# EAGLE design OMNIBUS Stepper board v3 (EAGLE 9.3.1)
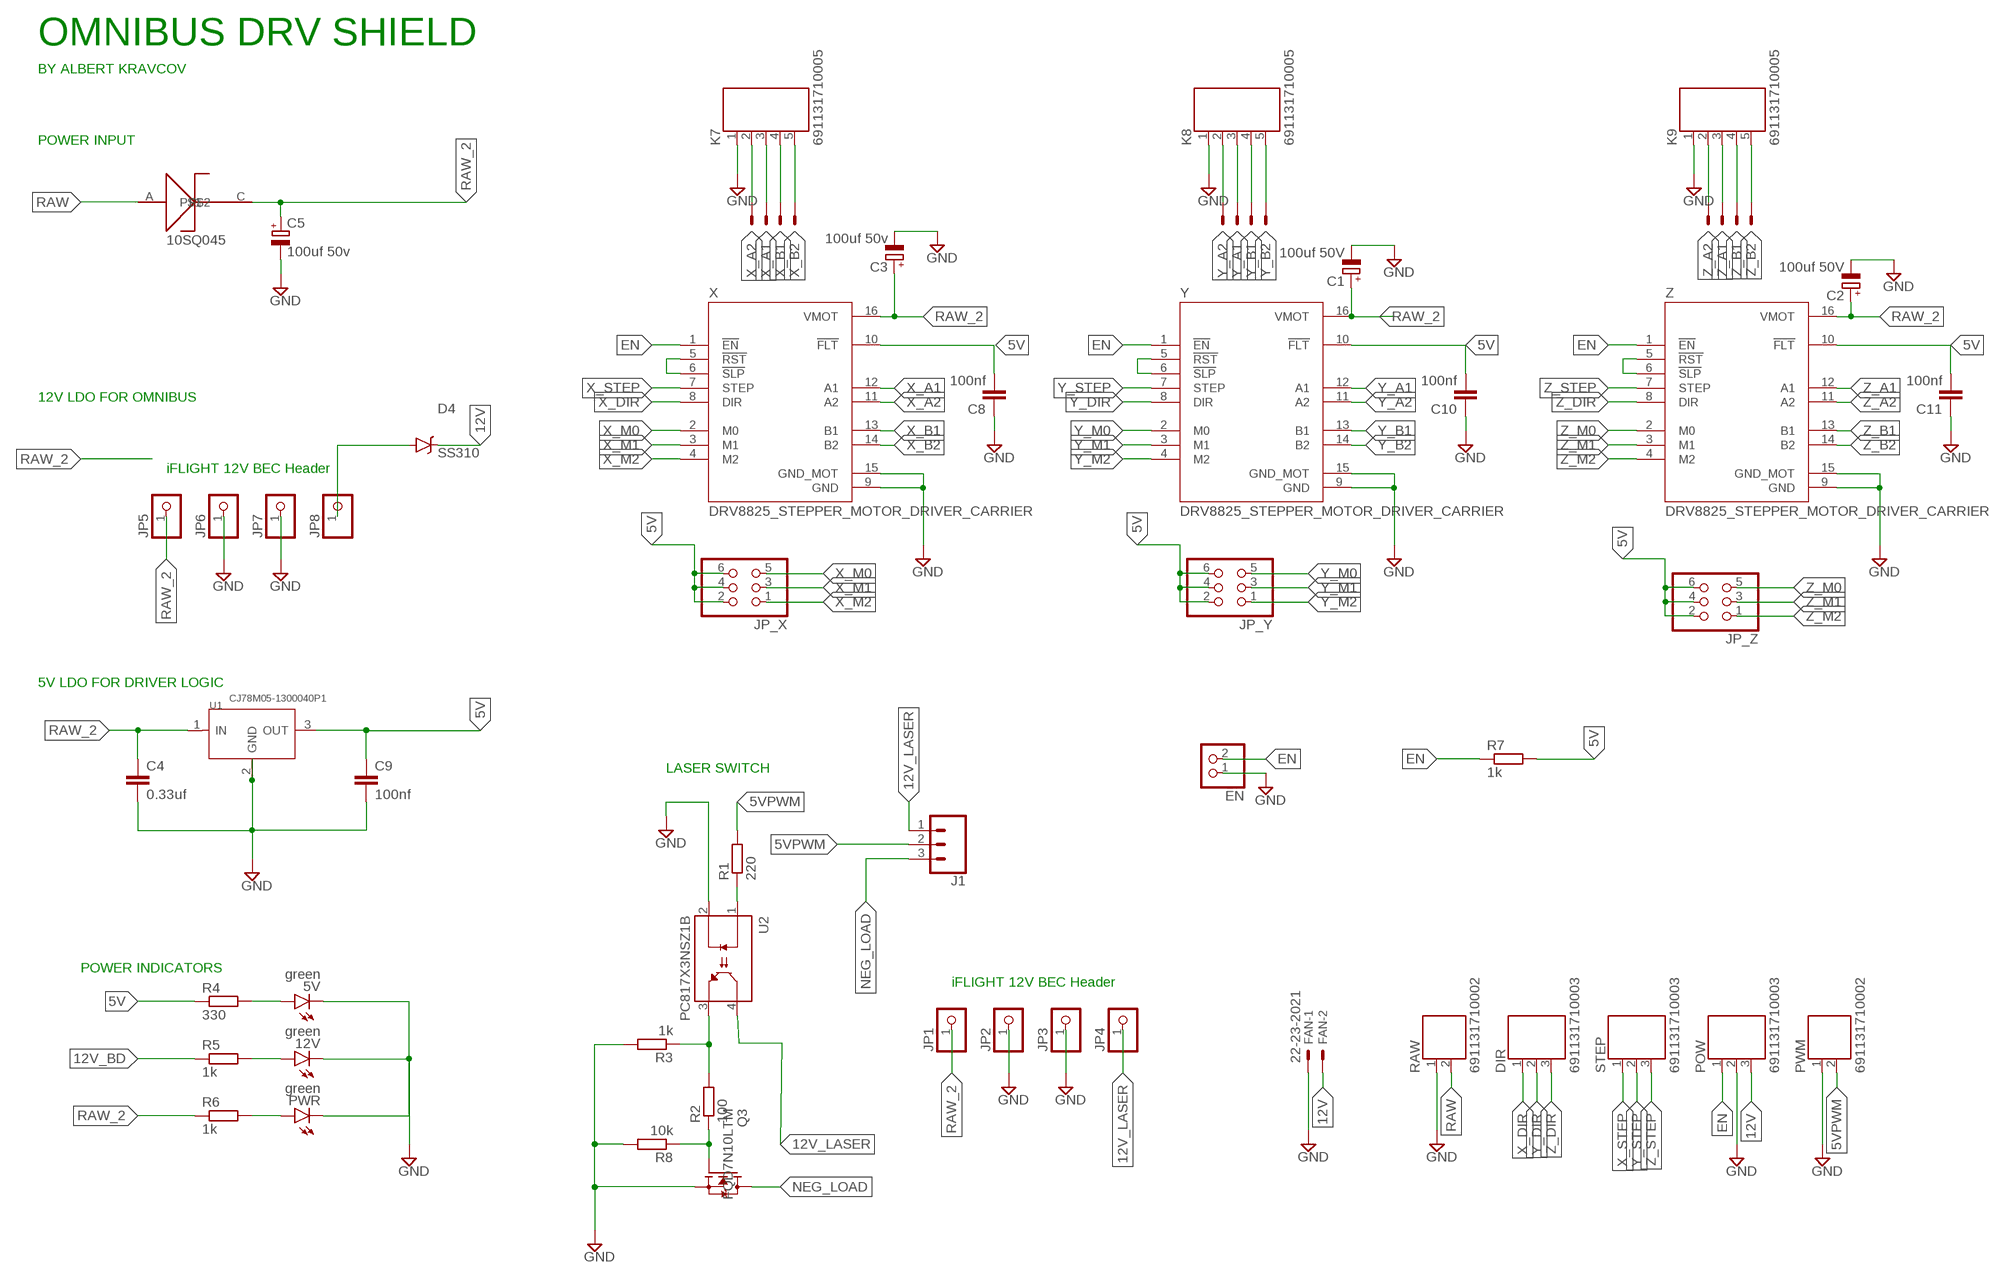
[diagram p0: schematic, sheet 1]

## Parts
5V  green  LEDCHIPLED_0805  [CHIPLED_0805]
12V  green  LEDCHIPLED_0805  [CHIPLED_0805]
C1  100uf 50V  CPOL-EUE5-6  [E5-6]
C2  100uf 50V  CPOL-EUE5-6  [E5-6]
C3  100uf 50v  CPOL-EUE5-6  [E5-6]
C4  0.33uf  C-EUC1206  [C1206]
C5  100uf 50v  CPOL-EUE5-8.5  [E5-8,5]
C8  100nf  C-EUC0805  [C0805]
C9  100nf  C-EUC1206  [C1206]
C10  100nf  C-EUC0805  [C0805]
C11  100nf  C-EUC0805  [C0805]
D1  10SQ045  10SQ050  [DIOAD885W125L910D885]
D4  SS310  SS54  [DO-214AC]
DIR  691131710003  [691131710003]
EN  PINHD-1X2  [1X02]
FAN  22-23-2021  [22-23-2021]
J1  CONN_03  [1X03]
JP1  PINHD-1X1  [1X01]
JP2  PINHD-1X1  [1X01]
JP3  PINHD-1X1  [1X01]
JP4  PINHD-1X1  [1X01]
JP5  PINHD-1X1  [1X01]
JP6  PINHD-1X1  [1X01]
JP7  PINHD-1X1  [1X01]
JP8  PINHD-1X1  [1X01]
JP_X  PINHD-2X3  [2X03]
JP_Y  PINHD-2X3  [2X03]
JP_Z  PINHD-2X3  [2X03]
K7  691131710005  [691131710005]
K8  691131710005  [691131710005]
K9  691131710005  [691131710005]
POW  691131710003  [691131710003]
PWM  691131710002  [691131710002]
PWR  green  LEDCHIPLED_0805  [CHIPLED_0805]
Q3  FQD7N10LTM  [TO-252]
R1  220  R-EU_R0805  [R0805]
R2  100  R-EU_R0805  [R0805]
R3  1k  R-EU_R0805  [R0805]
R4  330  R-EU_R0805  [R0805]
R5  1k  R-EU_R0805  [R0805]
R6  1k  R-EU_R1206  [R1206]
R7  1k  R-EU_R0805  [R0805]
R8  10k  R-EU_R0805  [R0805]
RAW  691131710002  [691131710002]
STEP  691131710003  [691131710003]
U1  CJ78M05-1300040P1  [TO252]
U2  PC817X3NSZ1B  [DIP762W50P254L495H455Q4]
X  DRV8825_STEPPER_MOTOR_DRIVER_CARRIER  [IC_DRV8825_STEPPER_MOTOR_DRIVER_CARRIER]
X_MOTOR  22-23-2041  [22-23-2041]
Y  DRV8825_STEPPER_MOTOR_DRIVER_CARRIER  [IC_DRV8825_STEPPER_MOTOR_DRIVER_CARRIER]
Y_MOTOR  22-23-2041  [22-23-2041]
Z  DRV8825_STEPPER_MOTOR_DRIVER_CARRIER  [IC_DRV8825_STEPPER_MOTOR_DRIVER_CARRIER]
Z_MOTOR  22-23-2041  [22-23-2041]

## Nets
5V [power]: C8.2 C9.1 C10.2 C11.2 JP_X.2 JP_X.4 JP_X.6 JP_Y.2 JP_Y.4 JP_Y.6 JP_Z.2 JP_Z.4 JP_Z.6 R4.1 R7.2 U1.3(OUT) X.10(!FLT) Y.10(!FLT) Z.10(!FLT)
5VPWM [power]: J1.2 PWM.2 R1.2
12V [ha]: D4.C FAN.2 POW.3
12V_BD [ha]: D4.A JP8.1 R5.1
12V_LASER [ha]: J1.1 JP4.1 U2.4(COLLECTOR)
EN: EN.2 POW.1 R7.1 X.1(!EN) Y.1(!EN) Z.1(!EN)
GND: 5V.C 12V.C C1.- C2.- C3.- C4.2 C5.- C8.1 C9.2 C10.1 C11.1 EN.1 FAN.1 JP2.1 JP3.1 JP6.1 JP7.1 K7.1 K8.1 K9.1 POW.2 PWM.1 PWR.C Q3.3(S) R3.2 R8.2 RAW.1 U1.2(GND) U2.2(CATHODE) X.9(GND) X.15(GND_MOT) Y.9(GND) Y.15(GND_MOT) Z.9(GND) Z.15(GND_MOT)
N$1: Q3.1(G) R2.1 R8.1
N$2: 5V.A R4.2
N$3 [power]: R1.1 U2.1(ANODE)
N$4 [power]: R2.2 R3.1 U2.3(EMITTER)
N$7: 12V.A R5.2
N$10: PWR.A R6.2
NC [power]: Z.5(!RST) Z.6(!SLP)
NC2 [power]: Y.5(!RST) Y.6(!SLP)
NC3 [power]: X.5(!RST) X.6(!SLP)
NEG_LOAD [power]: J1.3 Q3.T(D)
RAW [ha]: D1.A RAW.2
RAW_2 [ha]: C1.+ C2.+ C3.+ C4.1 C5.+ D1.C JP1.1 JP5.1 R6.1 U1.1(IN) X.16(VMOT) Y.16(VMOT) Z.16(VMOT)
X_A1 [ha]: K7.3 X.12(A1) X_MOTOR.3
X_A2 [ha]: K7.2 X.11(A2) X_MOTOR.4
X_B1 [ha]: K7.4 X.13(B1) X_MOTOR.2
X_B2 [ha]: K7.5 X.14(B2) X_MOTOR.1
X_DIR [power]: DIR.1 X.8(DIR)
X_M0: JP_X.5 X.2(M0)
X_M1: JP_X.3 X.3(M1)
X_M2: JP_X.1 X.4(M2)
X_STEP [power]: STEP.1 X.7(STEP)
Y_A1 [ha]: K8.3 Y.12(A1) Y_MOTOR.3
Y_A2 [ha]: K8.2 Y.11(A2) Y_MOTOR.4
Y_B1 [ha]: K8.4 Y.13(B1) Y_MOTOR.2
Y_B2 [ha]: K8.5 Y.14(B2) Y_MOTOR.1
Y_DIR [power]: DIR.2 Y.8(DIR)
Y_M0: JP_Y.5 Y.2(M0)
Y_M1: JP_Y.3 Y.3(M1)
Y_M2: JP_Y.1 Y.4(M2)
Y_STEP [power]: STEP.2 Y.7(STEP)
Z_A1 [ha]: K9.3 Z.12(A1) Z_MOTOR.3
Z_A2 [ha]: K9.2 Z.11(A2) Z_MOTOR.4
Z_B1 [ha]: K9.4 Z.13(B1) Z_MOTOR.2
Z_B2 [ha]: K9.5 Z.14(B2) Z_MOTOR.1
Z_DIR [power]: DIR.3 Z.8(DIR)
Z_M0: JP_Z.5 Z.2(M0)
Z_M1: JP_Z.3 Z.3(M1)
Z_M2: JP_Z.1 Z.4(M2)
Z_STEP [power]: STEP.3 Z.7(STEP)

## Notes on the sheet
- OMNIBUS DRV SHIELD
- BY ALBERT KRAVCOV
- POWER INPUT
- 10SQ045
- 12V LDO FOR OMNIBUS
- iFLIGHT 12V BEC Header
- 5V LDO FOR DRIVER LOGIC
- LASER SWITCH
- POWER INDICATORS
- iFLIGHT 12V BEC Header

## Library data of the parts
5V 12V PWR = led:LED: LED OSRAM: - CHIPLED LG R971, LG N971, LY N971, LG Q971, LY Q971, LO R971, LY R971 LH N974, LH R974 LS Q976, LO Q976, LY Q976 LO Q996 - Hyper CHIPLED LW Q18S LB Q993, LB Q99A, LB R99A - SideLED LS A670, LO A670, LY A670, LG A670, LP A670 LB A673, LV A673, LT A673, LW A673 LH A674 LY A675 LS A676, LA A676, LO A676, LY A676, LW A676 LS A679, LY A679, LG A679 - Hyper Micro SIDELED® LS Y876, LA Y876, LO Y876, LY Y876 LT Y87S - SmartLED LW L88C, LW L88S LB L89C, LB L89S, LG L890 LS L89K, LO L89K, LY L89K LS L896, LA L896, LO L896, LY L896 - TOPLED LS T670, LO T670, LY T670, LG T670, LP T670 LSG T670, LSP T670, LSY T670, LOP T670, LYG T670 LG T671, LOG T671, LSG T671 LB T673, LV T673, LT T673, LW T673 LH T674 LS T676, LA T676, LO T676, LY T676, LB T676, LH T676, LSB T676, LW T676 LB T67C, LV T67C, LT T67C, LS T67K, LO T67K, LY T67K, LW E67C LS E67B, LA E67B, LO E67B, LY E67B, LB E67C, LV E67C, LT E67C LW T67C LS T679, LY T679, LG T679 LS T770, LO T770, LY T770, LG T770, LP T770 LB T773, LV T773, LT T773, LW T773 LH T774 LS E675, LA E675, LY E675, LS T675 LS T776, LA T776, LO T776, LY T776, LB T776 LHGB T686 LT T68C, LB T68C - Hyper Mini TOPLED® LB M676 - Mini TOPLED Santana® LG M470 LS M47K, LO M47K, LY M47K Source: http://www.osram.convergy.de LUXEON: - LUMILED® LXK2-PW12-R00, LXK2-PW12-S00, LXK2-PW14-U00, LXK2-PW14-V00 LXK2-PM12-R00, LXK2-PM12-S00, LXK2-PM14-U00 LXK2-PE12-Q00, LXK2-PE12-R00, LXK2-PE12-S00, LXK2-PE14-T00, LXK2-PE14-U00 LXK2-PB12-K00, LXK2-PB12-L00, LXK2-PB12-M00, LXK2-PB14-N00, LXK2-PB14-P00, LXK2-PB14-Q00 LXK2-PR12-L00, LXK2-PR12-M00, LXK2-PR14-Q00, LXK2-PR14-R00 LXK2-PD12-Q00, LXK2-PD12-R00, LXK2-PD12-S00 LXK2-PH12-R00, LXK2-PH12-S00 LXK2-PL12-P00, LXK2-PL12-Q00, LXK2-PL12-R00 Source: www.luxeon.com KINGBRIGHT: KA-3528ASYC Source: www.kingbright.com
C1-C3 C5 = rcl:CPOL-EU: POLARIZED CAPACITOR, European symbol; SPICEPREFIX: C
C4 C8-C11 = rcl:C-EU: CAPACITOR, European symbol; SPICEPREFIX: C
D1 = DIOAD885W125L910D885:10SQ050
D4 = SS54:SS54: SCHOTTKY DIODES 40Vpeak, 28Vrms 5A (SBD) SMA(DO-214AC); AVAILABILITY: Unavailable; DESCRIPTION: Digital Switch Unipolar Switch Open Collector Hall Effect SOT-89B; MF: Honeywell Sensing; MP: SS54; PACKAGE: TO-243AA-243 Honeywell Sensing; PRICE: None
DIR POW STEP = Wurth_Terminal_Blocks_Connectors_rev15d:691131710003: WR-TBL Terminal block - CUU5/3 - 3 Pins;=>Code : Con_TBL_Screw_PClamp_5.00_6911317100xx_691131710003 <http://katalog.we-online.de/media/images/eican/Con_TBL_Screw_PClamp_5.00_6911317100xx_pf2.jpg> Details see: http://katalog.we-online.de/em/datasheet/6911317100xx.pdf Created 11/3/2014, Karrer Zheng 2014 (C) Wurth Elektronik
EN = pinhead:PINHD-1X2: PIN HEADER
FAN = con-molex:22-23-2021: .100" (2.54mm) Center Header - 2 Pin; MF: MOLEX; MPN: 22-23-2021; OC_FARNELL: 1462926; OC_NEWARK: 25C3832
J1 = SparkFun-Connectors:CONN_03: Multi connection point. Often used as Generic Header-pin footprint for 0.1 inch spaced/style header connections On any of the 0.1 inch spaced packages, you can populate with these: Break Away Headers - Straight <https://www.sparkfun.com/products/116> (PRT-00116) Break Away Male Headers - Right Angle <https://www.sparkfun.com/products/553> (PRT-00553) Female Headers <https://www.sparkfun.com/products/115> (PRT-00115) Break Away Headers - Machine Pin <https://www.sparkfun.com/products/117> (PRT-00117) Break Away Female Headers - Swiss Machine Pin <https://www.sparkfun.com/products/743> (PRT-00743) Stackable Header - 3 Pin (Female, 0.1") <https://www.sparkfun.com/products/13875> (PRT-13875) For SCREWTERMINALS and SPRING TERMINALS visit here: Screw Terimnals on SparkFun.com <https://www.sparkfun.com/search/results?term=Screw+Terminals> (5mm/3.5mm/2.54mm spacing) This device is also useful as a general connection point to wire up your design to another part of your project. Our various solder wires solder well into these plated through hole pads. Hook-Up Wire - Assortment (Stranded, 22 AWG) <https://www.sparkfun.com/products/11375> (PRT-11375) Hook-Up Wire - Assortment (Solid Core, 22 AWG) <https://www.sparkfun.com/products/11367> (PRT-11367) View the entire wire category on our website here <https://www.sparkfun.com/categories/141> Special notes: Molex polarized connector foot print use with SKU : PRT-08232 with associated crimp pins and housings.
JP1-JP8 = pinhead:PINHD-1X1: PIN HEADER
JP_X JP_Y JP_Z = pinhead:PINHD-2X3: PIN HEADER
K7-K9 = Wurth_Terminal_Blocks_Connectors_rev15d:691131710005: WR-TBL Terminal block - CUU5/5 - 5 Pins;=>Code : Con_TBL_Screw_PClamp_5.00_6911317100xx_691131710005 <http://katalog.we-online.de/media/images/eican/Con_TBL_Screw_PClamp_5.00_6911317100xx_pf2.jpg> Details see: http://katalog.we-online.de/em/datasheet/6911317100xx.pdf Created 11/3/2014, Karrer Zheng 2014 (C) Wurth Elektronik
PWM RAW = Wurth_Terminal_Blocks_Connectors_rev15d:691131710002: WR-TBL Terminal block - CUU5/2 CUU5/2GR - 2 Pins;=>Code : Con_TBL_Screw_PClamp_5.00_6911317100xx_691131710002 <http://katalog.we-online.de/media/images/eican/Con_TBL_Screw_PClamp_5.00_6911317100xx_pf2.jpg> Details see: http://katalog.we-online.de/em/datasheet/6911317100xx.pdf Created 11/23/2014, Karrer Zheng 2014 (C) Wurth Elektronik
Q3 = FQD7N10LTM:FQD7N10LTM: MOSFET N-CH 100V 5.8A 350mOhm 6nC DPAK Check prices <https://pricing.snapeda.com/parts/FQD7N10LTM/ON%20Semiconductor/view-part?ref=eda>; AVAILABILITY: Good; DESCRIPTION: N-Channel 100V 5.8A (Tc) 2.5W (Ta), 25W (Tc) Surface Mount D-Pak; MF: ON Semiconductor; MP: FQD7N10LTM; PACKAGE: TO-252-3 ON Semiconductor; PRICE: None; PURCHASE-URL: https://pricing.snapeda.com/search/part/FQD7N10LTM/?ref=eda
R1-R8 = rcl:R-EU_: RESISTOR, European symbol; SPICEPREFIX: R
U1 = CJ78M05:CJ78M05: 0.5A Three Terminal Positive Voltage Regulators Check prices <https://pricing.snapeda.com/parts/CJ78M05/JCET/view-part?ref=eda>; AVAILABILITY: No availability data; DESCRIPTION: SMD PMIC; LDO; Vin 25V; 5V; 0.5A; Without En; 1-Ch; MF: JCET; MP: CJ78M05; PACKAGE: None; PRICE: None
U2 = PC817X3NSZ1B:PC817X3NSZ1B: Optoisolator Transistor Output 1 Channel 4-DIP Check prices <https://pricing.snapeda.com/parts/PC817X3NSZ1B/Sharp%20Microelectronics/view-part?ref=eda>; AVAILABILITY: Bad; DESCRIPTION: Optoisolator Transistor Output 1 Channel 4-DIP; MF: Sharp Microelectronics; MP: PC817X3NSZ1B; PACKAGE: None; PRICE: None; PURCHASE-URL: https://pricing.snapeda.com/search/part/PC817X3NSZ1B/?ref=eda
X Y Z = DRV8825_STEPPER_MOTOR_DRIVER_CARRIER:DRV8825_STEPPER_MOTOR_DRIVER_CARRIER: Stepper motor controler; IC: DRV8825; 1.5A; Uin mot: 8.2÷45V; AVAILABILITY: Unavailable; DESCRIPTION: Stepper, Bipolar 8.2 ~ 45VDC Supply 1.5A 8.2 ~ 45V Load; MF: Pololu; MP: DRV8825 STEPPER MOTOR DRIVER CARRIER; PACKAGE: None; PRICE: None
X_MOTOR Y_MOTOR Z_MOTOR = con-molex:22-23-2041: .100" (2.54mm) Center Header - 4 Pin; MF: MOLEX; MPN: 22-23-2041; OC_FARNELL: 1462920; OC_NEWARK: 38C0355

## Net classes
0 default: width 0.305 mm, drill 0.305 mm, clearance 0.305 mm
1 power: width 0.635 mm, drill 0.635 mm, clearance 0.635 mm
2 ha: width 1.524 mm, drill 0.762 mm, clearance 1.27 mm

## Board
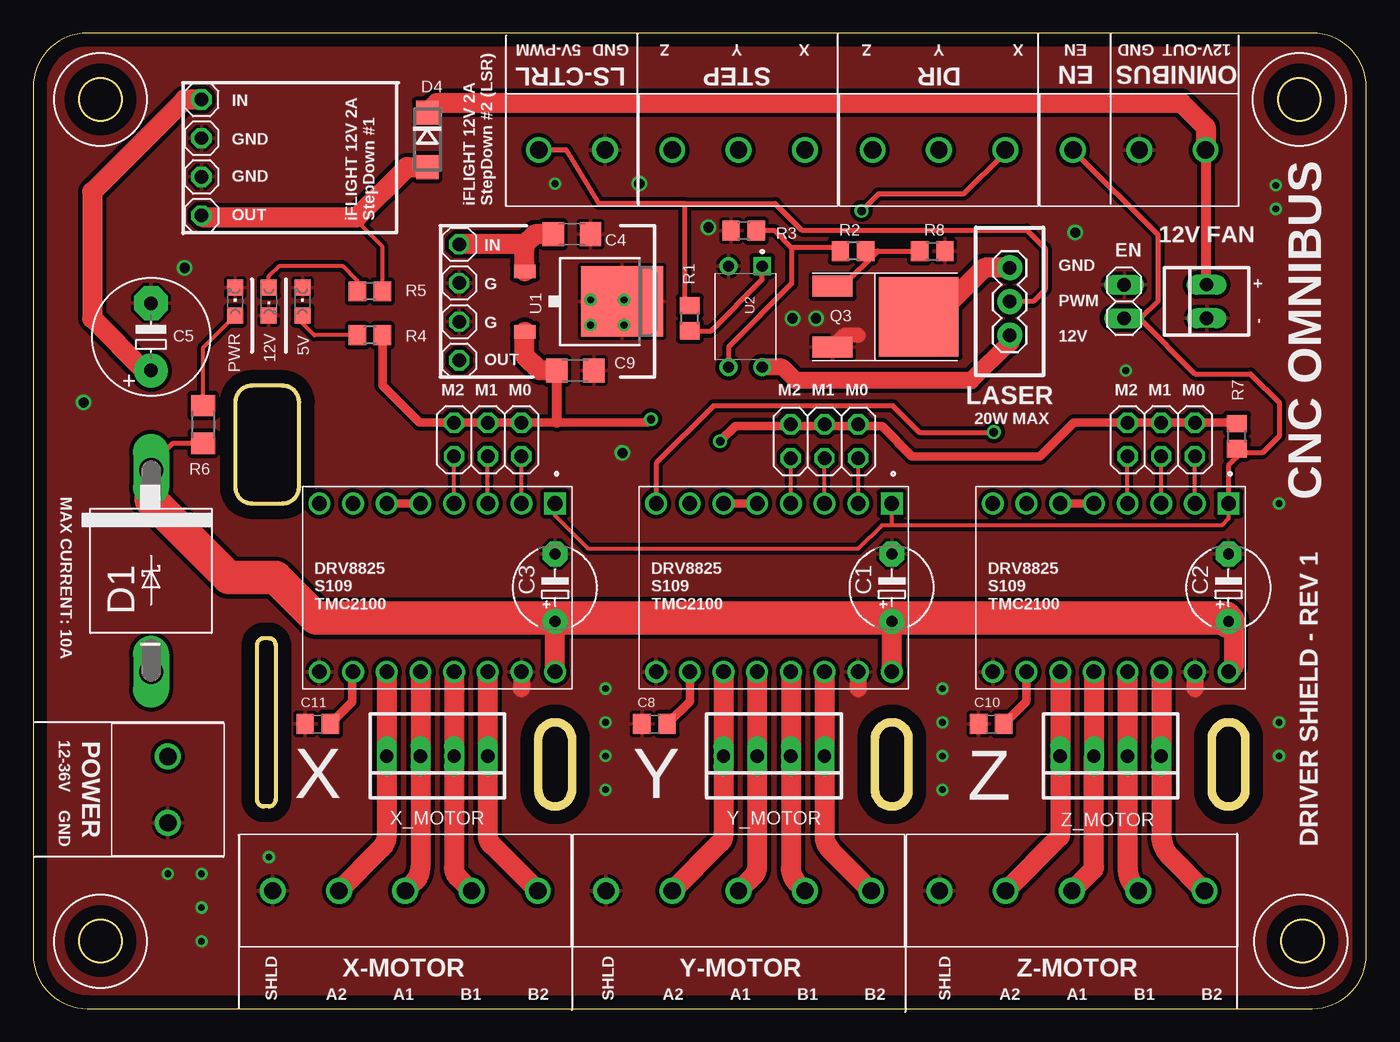
[diagram p1: board, top side]
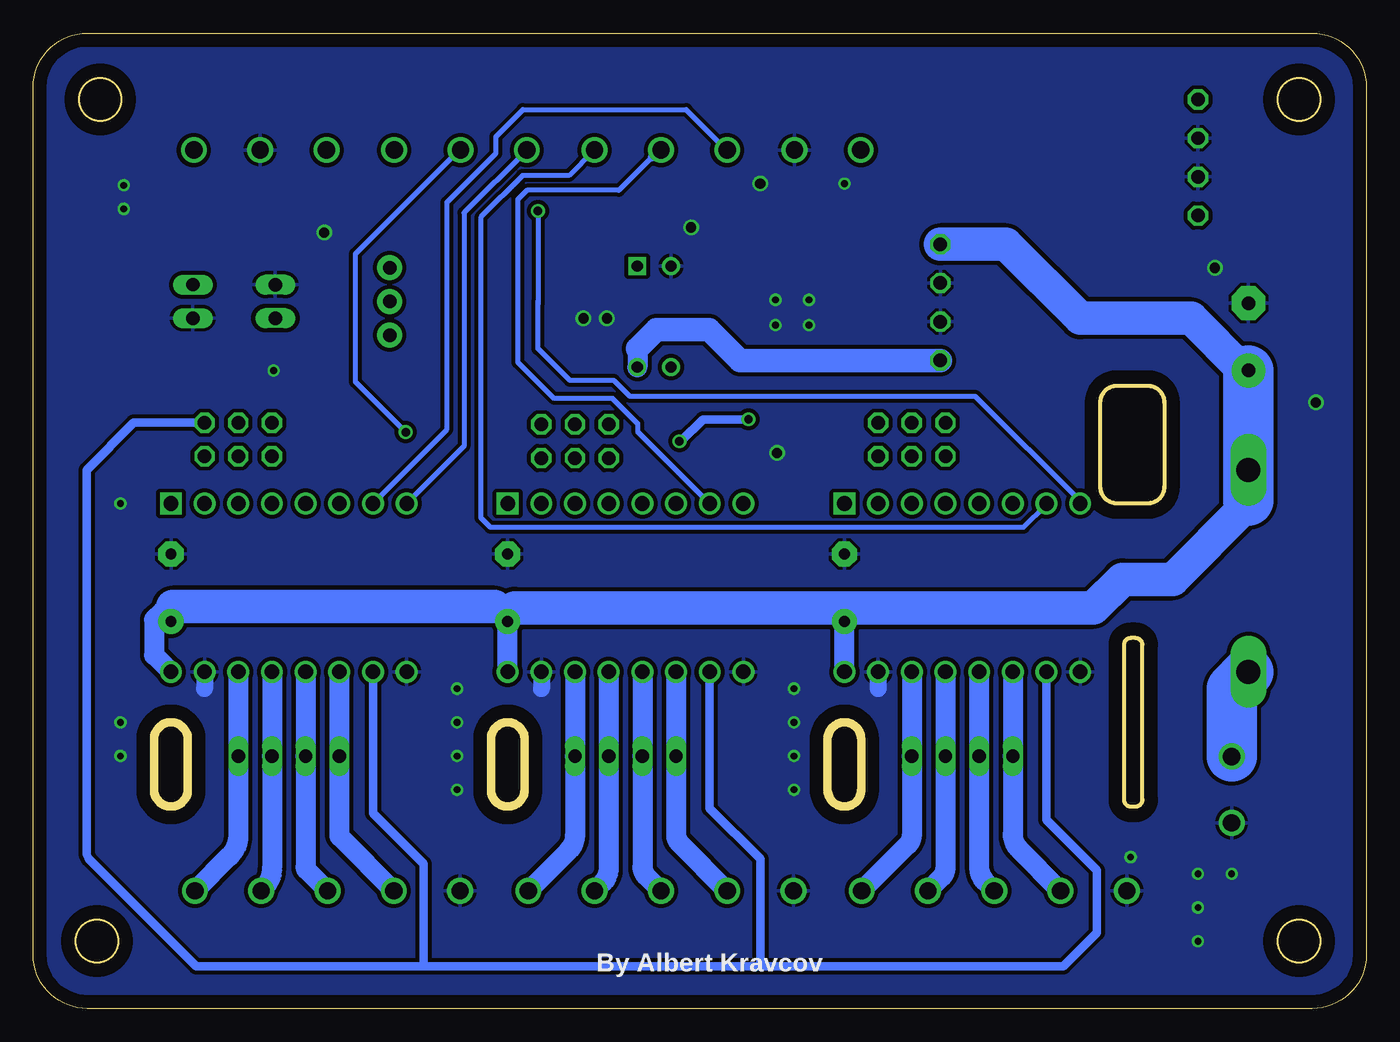
[diagram p2: board, bottom side, seen from below]

Size 100.56 x 73.58 mm. Coordinates in mm from the lower left corner, seen from the top.
Outline: 0,69.52 0,4.06 arc90 4.06,0 96.5,0 arc90 100.56,4.06 100.56,69.52 arc90 96.5,73.58 4.06,73.58 arc90 0,69.52
Outline: 15.24,45.72 15.24,39.37 arc90 16.51,38.1 18.8,38.1 arc90 20.07,39.37 20.07,45.72 arc90 18.8,46.99 16.51,46.99 arc90 15.24,45.72
Outline: 39.37,15.24 arc-90 38.1,16.51 38.1,20.32 arc-90 39.37,21.59 arc-90 40.64,20.32 40.64,16.51 arc-90 39.37,15.24
Outline: 64.77,15.24 arc-90 63.5,16.51 63.5,20.32 arc-90 64.77,21.59 arc-90 66.04,20.32 66.04,16.51 arc-90 64.77,15.24
Outline: 88.9,16.51 88.9,20.32 arc-90 90.17,21.59 arc-90 91.44,20.32 91.44,16.51 arc-90 90.17,15.24 arc-90 88.9,16.51
Outline: 17.78,15.24 17.4,15.24 arc-90 16.89,15.75 16.89,27.43 arc-90 17.4,27.94 17.78,27.94 arc-90 18.29,27.43 18.29,15.75 arc-90 17.78,15.24
Outline: circle at 5.08,5.08 radius 1.6
Outline: circle at 95.76,5.08 radius 1.6
Outline: circle at 5.08,68.58 radius 1.6
Outline: circle at 95.5,68.58 radius 1.6
Copper layers (1*16): Top 0.035mm / dielectric 1.5mm / Bottom 0.035mm
Design rules "default *": minimum track width 6mil, minimum drill 0.35mm, track to track 6mil, track to pad 6mil, pad to pad 6mil, via to via 6mil, smd to smd 6mil, copper to edge 40mil, drill to drill 6mil, minimum pad ring 10mil, minimum via ring 8mil, stop-mask expansion 4mil, vias tented up to drill 2mm, thermal gap 10mil

### Footprints (pad centres in the part's own frame; a part is rotated, then mirrored left to right if it is on the bottom)
CHIPLED_0805 = smd 1.2 x 1.2: A 0,-1.05; C 0,1.05
E5-6 = drill 0.813 pad 1.905: + -2.54,0 | drill 0.813 pad 1.905 octagon: - 2.54,0
C1206 = smd 1.6 x 1.8: 1 -1.4,0; 2 1.4,0
E5-8,5 = drill 1.016 pad 2.54: + -2.54,0 | drill 1.016 pad 2.54 octagon: - 2.54,0
C0805 = smd 1.3 x 1.5: 1 -0.95,0; 2 0.95,0
DIOAD885W125L910D885 = drill 1.803 long: A 7.62,0; C -7.62,0
DO-214AC = smd 1.8 x 1.7: A 2.05,0; C -2.05,0
691131710003 = drill 1.3: 1 -5,0; 2 0,0; 3 5,0
1X02 = drill 1.016 long: 1 -1.27,0; 2 1.27,0
22-23-2021 = drill 1 long: 1 -1.27,0; 2 1.27,0
1X03 = drill 1.016 pad 1.88: 1 0,0; 2 2.54,0; 3 5.08,0
1X01 = drill 1.016 octagon: 1 0,0
2X03 = drill 1.016 octagon: 1 -2.54,-1.27; 2 -2.54,1.27; 3 0,-1.27; 4 0,1.27; 5 2.54,-1.27; 6 2.54,1.27
691131710005 = drill 1.3: 1 -10,0; 2 -5,0; 3 0,0; 4 5,0; 5 10,0
691131710002 = drill 1.3: 1 -2.5,0; 2 2.5,0
TO-252 = smd 1.6 x 3: 1 -2.3,-6.5; 3 2.3,-6.5 | smd 6 x 6: T 0,0
R0805 = smd 1.3 x 1.5: 1 -0.95,0; 2 0.95,0
R1206 = smd 1.6 x 1.803: 1 -1.422,0; 2 1.422,0
TO252 = smd 1.016 x 1.651: 1 -2.286,-4.826; 3 2.286,-4.826 | smd 5.3 x 6.2: 2 0,2.5
DIP762W50P254L495H455Q4 = drill 0.84 pad 1.26 square: 1 -3.81,1.27 | drill 0.84 pad 1.26: 2 -3.81,-1.27; 3 3.81,-1.27; 4 3.81,1.27
IC_DRV8825_STEPPER_MOTOR_DRIVER_CARRIER = drill 1.1 square: 1 -6.35,8.89 | drill 1.1: 2 -6.35,6.35; 3 -6.35,3.81; 4 -6.35,1.27; 5 -6.35,-1.27; 6 -6.35,-3.81; 7 -6.35,-6.35; 8 -6.35,-8.89; 9 6.35,-8.89; 10 6.35,-6.35; 11 6.35,-3.81; 12 6.35,-1.27; 13 6.35,1.27; 14 6.35,3.81; 15 6.35,6.35; 16 6.35,8.89
22-23-2041 = drill 1 long: 1 -3.81,0; 2 -1.27,0; 3 1.27,0; 4 3.81,0

### Placement (x,y rotation side)
5V  20.32,53.34 0 top
12V  17.78,53.34 180 top
C1  64.77,31.75 90 top
C2  90.17,31.75 90 top
C3  39.37,31.75 90 top
C4  40.64,58.42 0 top
C5  8.89,50.67 90 top
C8  46.86,21.46 0 top
C9  40.89,48.13 0 top
C10  72.26,21.46 0 top
C11  21.46,21.46 0 top
D1  8.89,33.02 270 top
D4  29.72,65.53 270 top
DIR  68.33,64.77 180 top
EN  82.3,53.34 270 top
FAN  88.52,53.34 90 top
J1  73.66,50.8 90 top
JP1  32.13,57.66 0 top
JP2  32.13,54.74 0 top
JP3  32.13,51.82 0 top
JP4  32.13,48.9 0 top
JP5  12.7,68.58 180 top
JP6  12.7,65.66 0 top
JP7  12.7,62.74 0 top
JP8  12.7,59.82 0 top
JP_X  34.29,42.93 0 top
JP_Y  59.69,42.8 0 top
JP_Z  85.09,42.93 0 top
K7  28.07,8.89 0 top
K8  53.21,8.89 0 top
K9  78.36,8.89 0 top
POW  83.44,64.77 0 top
PWM  40.64,64.77 180 top
PWR  15.24,53.34 0 top
Q3  66.8,52.2 270 top
R1  49.53,52.07 90 top
R2  61.85,57.15 180 top
R3  53.59,58.67 180 top
R4  25.4,50.8 180 top
R5  25.4,54.1 180 top
R6  12.83,44.07 90 top
R7  90.81,43.18 90 top
R8  67.82,57.15 0 top
RAW  10.16,16.51 90 top
STEP  53.21,64.77 180 top
U1  41.91,53.34 270 top
U2  53.72,52.2 270 top
X  30.48,31.75 270 top
X_MOTOR  30.48,19.05 180 top
Y  55.88,31.75 270 top
Y_MOTOR  55.88,19.05 180 top
Z  81.28,31.75 270 top
Z_MOTOR  81.28,19.05 180 top

### Tracks (layer width: path | path; a pad name or v marks a point on that pad's centre or on a via)
5V  (via drill 0.64)
  Top 0.635: R4.1 26.35,46.99 29.14,44.2 JP_X.2 JP_X.4 JP_X.6 39.49,44.2 46.35,44.2 v46.61,44.45 | R7.2 90.74,44.2 JP_Z.6 JP_Z.4 JP_Z.2 78.49,44.2 75.95,41.66 66.29,41.66 64.01,43.94 62.36,43.94 JP_Y.6 62.1,43.94 59.82,43.94 JP_Y.4 59.56,43.94 57.28,43.94 JP_Y.2 57.02,43.94 52.96,43.94 v51.82,42.8 | C11.2 24.06,23.11 24.06,25.33 X.10 | C8.2 49.53,23.18 Y.10 | C10.2 74.93,23.18 Z.10
  Top 0.762: C9.1 39.49,44.2
  Top 1.524: C9.1 38.23,48.13 37.08,49.28 U1.3
  Bottom 0.635: 45.72,3.17 22.86,3.17 20.32,5.71 20.32,10.41 24.13,14.22 X.10 | 45.72,3.17 71.12,3.17 | 71.12,3.17 88.27,3.17 96.37,11.28 96.52,11.64 96.52,40.64 92.96,44.2 JP_Z.6 | 71.12,3.17 71.12,10.92 74.93,14.73 Z.10 | 45.72,3.17 45.72,11.29 49.53,15.1 Y.10 | v51.82,42.8 51.69,42.8 50.04,44.45 v46.61,44.45
5VPWM
  Top 0.381: 49.15,60.73 42.67,60.73 40.22,64.77 PWM.2 | 49.15,60.73 49.15,53.4 R1.2 | J1.2 75.44,53.34 76.35,54.25 76.35,57.33 74.96,58.73 57.96,58.73 55.96,60.73 49.15,60.73
  Bottom 0.305: PWM.2 38.1,64.77
12V
  Top 0.762: POW.3 88.44,54.69 FAN.2
  Top 1.524: POW.3 88.44,66.5 86.61,68.33 30.46,68.33 D4.C
12V_BD
  Top 0.305: R5.1 26.35,57.47 24.13,59.69
  Top 1.524: JP8.1 12.83,59.69 24.13,59.69 24.4,59.69 28.19,63.48 D4.A
12V_LASER
  Top 1.27: 73.66,50.29 70.74,47.37 57.53,47.37 56.52,48.39 U2.4
  Top 1.524: J1.1 73.66,50.29
  Bottom 1.524: 54.99,49.78 U2.4
  Bottom 1.778: JP4.1 47.24,48.9 49.57,51.22 53.55,51.22 54.99,49.78
EN
  Top 0.305: Z.1 90.17,36.96 89.66,36.45 64.77,36.45 | 64.77,36.45 Y.1 | X.1 39.37,37.21 41.91,34.67 62.23,34.67 64.01,36.45 64.77,36.45
  Top 0.381: 91.28,42.07 90.17,40.96 Z.1 | POW.1 84.84,58.37 84.84,53.34 83.57,52.07 EN.2 83.44,52.07 87.63,47.88 91.82,47.88 93.98,45.72 93.98,43.18 92.71,41.91 91.12,41.91 R7.1
  Top 0.635: 91.28,42.07 90.97,42.07 R7.1
GND  (via drill 0.51, 0.76)
  Top 1.143: 62.23,50.8 61.2,50.8 Q3.3
  Top 1.27: X.15 36.83,24.13 | Y.15 62.23,24.13 | Z.15 87.63,24.13
  Bottom 1.27: X.15 36.83,24.13 | Y.15 62.23,24.13 | Z.15 87.63,24.13
  other vias: 43.18,24.13 43.18,21.59 43.18,19.05 17.78,11.43 10.16,10.16 12.7,10.16 12.7,7.62 12.7,5.08 43.18,16.51 68.58,24.13 68.58,21.59 68.58,19.05 68.58,16.51 93.98,21.59 93.98,19.05 50.93,58.93 44.45,41.91 39.37,62.23 45.72,62.23 93.73,60.33 93.73,62.1 82.42,48.13 93.98,38.1 11.43,55.88 3.81,45.72 78.61,58.55 42.04,51.56 44.58,51.56 44.58,53.47 42.04,53.47 57.28,52.07 59.05,52.07
  pour Top: -1.27,73.66 -1.27,-0.86 arc45 -0.08,-3.73 0,-3.81 101.6,-3.81 101.6,69.44 arc45 100.41,72.31 99.06,73.66
  pour Bottom: -3.81,77.47 -3.81,-5.08 101.19,-5.08 arc-45 104.06,-6.27 104.14,-6.35 104.14,71.98 arc45 102.95,74.85 100.33,77.47
N$1
  Top 0.381: Q3.1 61.06,54.5 63.72,57.15 R8.1 R2.1
N$2
  Top 0.305: 5V.A 20.32,51.69 21.21,50.8 R4.2
N$3
  Top 0.381: R1.1 51.12,51.12 54.99,54.99 U2.1
N$4
  Top 0.381: R2.2 60.64,57.4 57.22,57.4 | 57.22,57.4 55.95,58.67 R3.1 54.92,58.67 | 57.22,57.4 57.22,54.68 52.45,49.91 U2.3
N$7
  Top 0.305: R5.2 24.45,54.93 23.37,56.01 18.54,56.01 17.78,55.25 12V.A
N$10
  Top 0.305: R6.2 12.83,49.88 PWR.A
NC
  Top 0.635: Z.5 Z.6
NC2
  Top 0.635: Y.5 Y.6
NC3
  Top 0.635: X.5 X.6
NEG_LOAD
  Top 1.143: Q3.T 68.71,52.2
  Top 1.524: J1.3 71.76,55.88 68.71,52.83 68.71,52.2
RAW
  Bottom 3.81: RAW.2 10.16,24.13 D1.A
RAW_2
  Top 0.381: 8.89,41 10.54,42.65 R6.1
  Top 1.524: Y.16 C1.+ | 90.55,29.08 90.55,25.78 Z.16 | 90.23,29.4 C2.+ | C5.+ 8.38,48.13 4.45,52.07 4.45,61.6 11.43,68.58 JP5.1 | D1.C 8.89,41 | X.16 C3.+ | U1.1 37.08,57.66 | 37.08,57.66 JP1.1 | 37.08,57.66 37.18,57.66 | C4.1 37.85,58.42 37.08,57.66
  Top 1.778: 90.55,29.08 90.23,29.4
  Top 2.54: D1.C 8.89,38.35 14.73,32.51 18.29,32.51 21.34,29.46 39.33,29.46 C3.+ | 39.5,29.46 64.73,29.46 C1.+ 65.02,29.46 89.92,29.46 C2.+
  Bottom 1.524: X.16 C3.+ | C1.+ 64.26,30.23 | Y.16 C1.+ | Z.16 91.44,26.67 91.44,29.34 90.81,29.97 C2.+ | C2.+ 90.04,30.1 | 65.75,30.32 65.41,29.97 C1.+ | 90.06,30.32 C2.+
  Bottom 2.54: 64.26,30.23 20.57,30.23 18.41,32.38 14.61,32.38 9.04,37.95 arc-45 8.89,38.31 | 65.75,30.32 90.06,30.32 | C5.+ 9.27,48.13 13.21,52.07 21.59,52.07 27.18,57.66 JP1.1
  Bottom 3.81: 8.89,38.31 D1.C C5.+
X_A1
  Top 1.524: K7.3 28.75,9.57 arc45 29.21,10.69 X_MOTOR.3 X.12
  Bottom 1.524: X.12 X_MOTOR.3 29.21,10.69 arc-45 28.75,9.57 K7.3
X_A2
  Top 1.524: K7.2 26.21,12.03 arc45 26.67,13.15 X_MOTOR.4 X.11
  Bottom 1.524: X.11 X_MOTOR.4 26.67,13.15 arc-45 26.21,12.03 K7.2
X_B1
  Top 1.524: K7.4 32.03,9.92 arc-45 31.75,10.61 X_MOTOR.2 X.13
  Bottom 1.524: X.13 X_MOTOR.2 31.75,10.61 arc45 32.03,9.92 K7.4
X_B2
  Top 1.524: K7.5 34.57,12.38 arc-45 34.29,13.07 X_MOTOR.1 X.14
  Bottom 1.524: X.14 X_MOTOR.1 34.29,13.07 arc45 34.57,12.38 K7.5
X_DIR  (via drill 0.64)
  Top 0.381: v62.48,60.17 63.75,61.44 70.18,61.44 73.17,64.43
  Top 0.635: 73.17,64.43 DIR.1
  Bottom 0.381: 21.59,38.28 29.52,46.2 55.57,46.2 56.76,47.38 60.08,47.38 62.48,49.78 62.48,53.34 | v62.48,60.17 62.48,53.34 | 62.48,53.34 62.48,53.11
  Bottom 0.635: 21.59,38.28 X.8
X_M0
  Top 0.305: X.2 JP_X.5
X_M1
  Top 0.305: X.3 JP_X.3
X_M2
  Top 0.305: X.4 JP_X.1
X_STEP
  Bottom 0.381: 24.18,38 25.86,36.32 66.09,36.32 66.8,37.03 66.8,59.69 63.65,62.84 60.15,62.84 58.32,64.67 | STEP.1
  Bottom 0.635: 24.18,38 X.7 | 58.32,64.67 STEP.1
Y_A1
  Top 1.524: Y.12 Y_MOTOR.3 54.61,10.69 arc-45 54.33,10 K8.3
  Bottom 1.524: Y.12 Y_MOTOR.3 54.61,10.69 arc-45 54.33,10 K8.3
Y_A2
  Top 1.524: Y.11 Y_MOTOR.4 52.07,13.15 arc-45 51.79,12.46 K8.2
  Bottom 1.524: Y.11 Y_MOTOR.4 52.07,13.15 arc-45 51.79,12.46 K8.2
Y_B1
  Top 1.524: Y.13 Y_MOTOR.2 57.15,10.61 arc45 57.61,9.49 K8.4
  Bottom 1.524: Y.13 Y_MOTOR.2 57.15,10.61 arc45 57.61,9.49 K8.4
Y_B2
  Top 1.524: Y.14 Y_MOTOR.1 59.69,13.07 arc45 60.15,11.95 K8.5
  Bottom 1.524: Y.14 Y_MOTOR.1 59.69,13.07 arc45 60.15,11.95 K8.5
Y_DIR  (via drill 0.64)
  Top 0.381: Y.8 46.99,41.15 51.31,45.47 64.87,45.47 66.9,43.43 72.42,43.43 v72.47,43.49
  Bottom 0.381: v72.47,43.49 76.28,47.3 76.28,56.92 68.73,64.47
  Bottom 0.635: 68.73,64.47 DIR.2
Y_M0
  Top 0.305: JP_Y.5 Y.2
Y_M1
  Top 0.305: Y.3 JP_Y.3
Y_M2
  Top 0.305: Y.4 JP_Y.1
Y_STEP
  Bottom 0.381: STEP.2 53.72,64.26 | Y.7 54.97,43.54 54.97,44.15 56.84,46.03 61.27,46.03 64.01,48.77 64.01,61.04 63.32,61.72 56.39,61.72 53.9,64.21
  Bottom 0.635: 53.9,64.21 STEP.2
Z_A1
  Top 1.524: K9.3 79.91,10.44 arc45 80.01,10.69 Z_MOTOR.3 Z.12
  Bottom 1.524: Z.12 Z_MOTOR.3 80.01,10.69 arc-45 79.91,10.44 K9.3
Z_A2
  Top 1.524: K9.2 77.37,12.9 arc45 77.47,13.15 Z_MOTOR.4 Z.11
  Bottom 1.524: Z.11 Z_MOTOR.4 77.47,13.15 arc-45 77.37,12.9 K9.2
Z_B1
  Top 1.524: K9.4 83.19,9.06 arc-45 82.55,10.61 Z_MOTOR.2 Z.13
  Bottom 1.524: Z.13 Z_MOTOR.2 82.55,10.61 arc45 83.19,9.06 K9.4
Z_B2
  Top 1.524: K9.5 85.73,11.52 arc-45 85.09,13.07 Z_MOTOR.1 Z.14
  Bottom 1.524: Z.14 Z_MOTOR.1 85.09,13.07 arc45 85.73,11.52 K9.5
Z_DIR
  Bottom 0.381: DIR.3 68.07,60.02 68.07,42.42 Z.8
Z_M0
  Top 0.305: Z.2 JP_Z.5
Z_M1
  Top 0.305: Z.3 JP_Z.3
Z_M2
  Top 0.305: Z.4 JP_Z.1
Z_STEP
  Bottom 0.381: Z.7 69.34,43.69 69.34,60.83 65.66,64.52 65.66,65.79 63.63,67.82 51.31,67.82 48.26,64.77 STEP.3

### Text on the board
tNames: 5V-PWM | GND | Z | Y | X | Z | Y | X | EN | GND | 12V-OUT | LS-CTRL | STEP | DIR | EN | OMNIBUS | IN | GND | GND | iFLIGHT 12V 2A / StepDown #2 (LSR) | OUT | iFLIGHT 12V 2A / StepDown #1 | 12V FAN | IN | GND | G | + | PWM | G | - | CNC OMNIBUS | 12V | OUT | M2 | M1 | M0 | M2 | M1 | M0 | M2 | M1 | M0 | LASER | 20W MAX | MAX CURRENT: 10A | DRV8825 / S109 / TMC2100 | DRV8825 / S109 / TMC2100 | DRV8825 / S109 / TMC2100 | DRIVER SHIELD - REV 1 | 12-36V | POWER | GND | SHLD | X-MOTOR | SHLD | Y-MOTOR | SHLD | Z-MOTOR | A2 | A1 | B1 | B2 | A2 | A1 | B1 | B2 | A2 | A1 | B1 | B2
bNames: By Albert Kravcov